# Altium schematic sheet PS3604LRCF.SchDoc: PS3604LRCF
size A3; Author: Storozhenko Roman; CompanyName: D_EL; DrawnBy: Storozhenko Roman; Address1: Ukraine; Address2: Kharkiv; Revision: 1.1; SheetNumber: 1; SheetTotal: 1
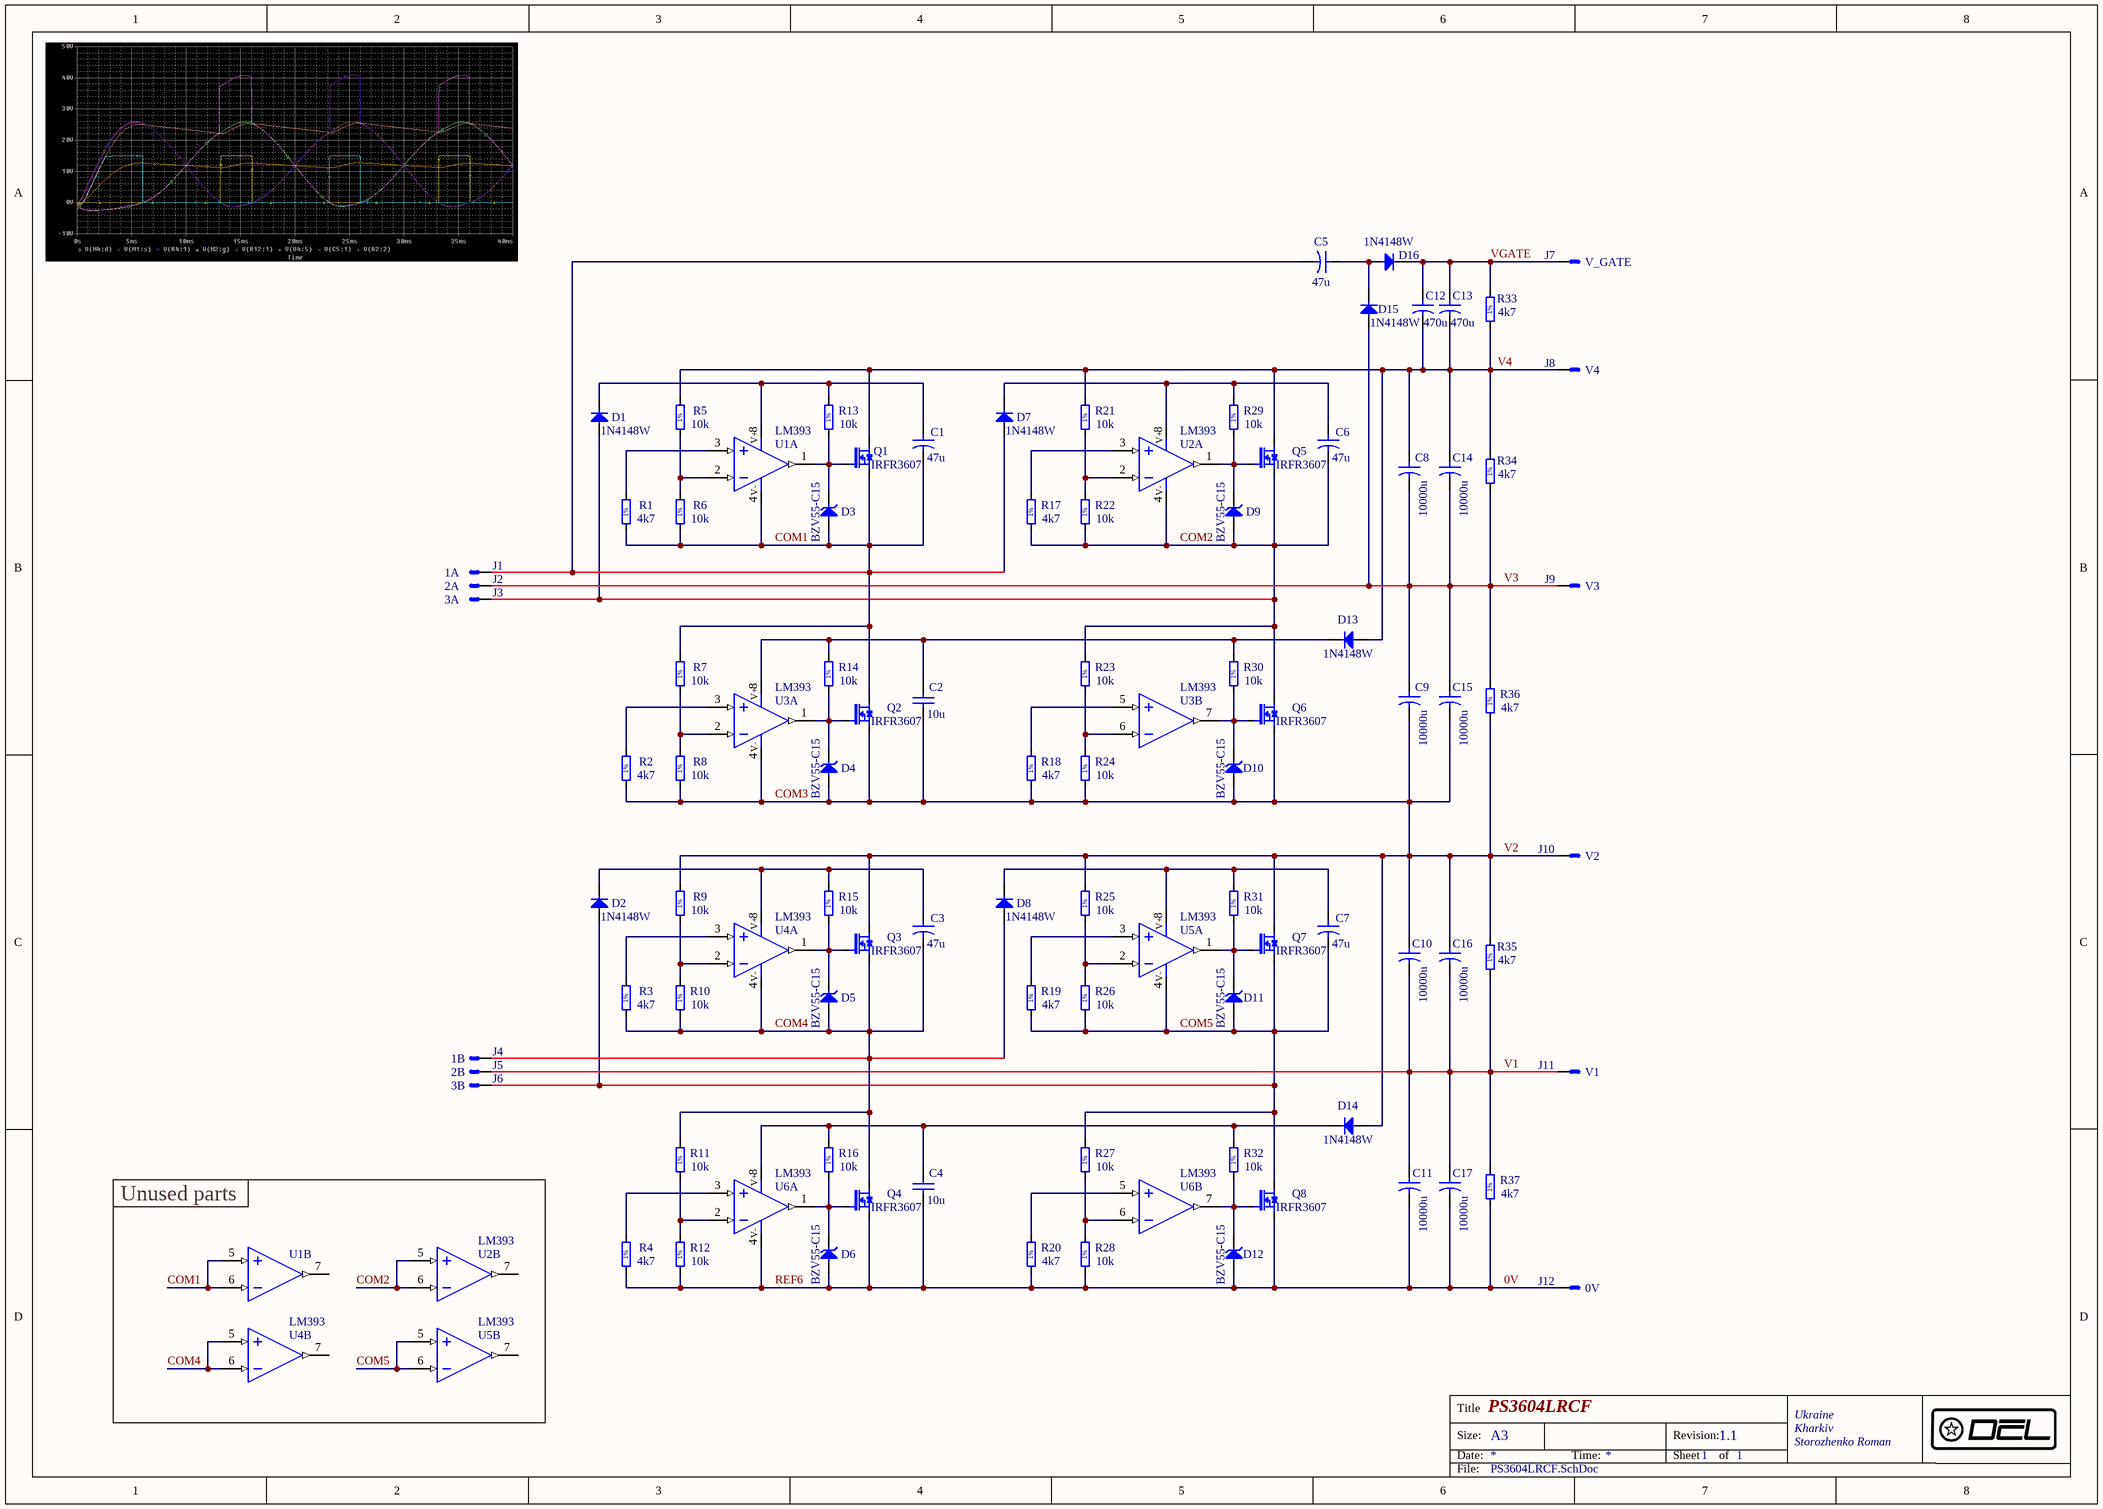
[diagram p0: PS3604LRCF.SchDoc]

## Parts
C1  47u  [CAPPR250-630X1120]
C2  10u  [CAPC2012X135N]
C3  47u  [CAPPR250-630X1120]
C4  10u  [CAPC2012X135N]
C5  47u  [CAPPR250-630X1120]
C6  47u  [CAPPR250-630X1120]
C7  47u  [CAPPR250-630X1120]
C8  10000u  [CAPPR750-1850X3750]
C9  10000u  [CAPPR750-1850X3750]
C10  10000u  [CAPPR750-1850X3750]
C11  10000u  [CAPPR750-1850X3750]
C12  470u  [CAPPR500-1050X2200]
C13  470u  [CAPPR500-1050X2200]
C14  10000u  [CAPPR750-1850X3750]
C15  10000u  [CAPPR750-1850X3750]
C16  10000u  [CAPPR750-1850X3750]
C17  10000u  [CAPPR750-1850X3750]
D1  1N4148W  [SOD3715X145N]
D2  1N4148W  [SOD3715X145N]
D3  BZV55-C15  [DIOMELF3515N]
D4  BZV55-C15  [DIOMELF3515N]
D5  BZV55-C15  [DIOMELF3515N]
D6  BZV55-C15  [DIOMELF3515N]
D7  1N4148W  [SOD3715X145N]
D8  1N4148W  [SOD3715X145N]
D9  BZV55-C15  [DIOMELF3515N]
D10  BZV55-C15  [DIOMELF3515N]
D11  BZV55-C15  [DIOMELF3515N]
D12  BZV55-C15  [DIOMELF3515N]
D13  1N4148W  [SOD3715X145N]
D14  1N4148W  [SOD3715X145N]
D15  1N4148W  [SOD3715X145N]
D16  1N4148W  [SOD3715X145N]
J1  Quixon™  [MOLEX_19_70_54203]  (value not drawn)
J2  Quixon™  [MOLEX_19_70_54203]  (value not drawn)
J3  Quixon™  [MOLEX_19_70_54203]  (value not drawn)
J4  Quixon™  [MOLEX_19_70_54203]  (value not drawn)
J5  Quixon™  [MOLEX_19_70_54203]  (value not drawn)
J6  Quixon™  [MOLEX_19_70_54203]  (value not drawn)
J7  Quixon™  [MOLEX_19_70_54203]  (value not drawn)
J8  Quixon™  [MOLEX_19_70_54203]  (value not drawn)
J9  Quixon™  [MOLEX_19_70_54203]  (value not drawn)
J10  Quixon™  [MOLEX_19_70_54203]  (value not drawn)
J11  Quixon™  [MOLEX_19_70_54203]  (value not drawn)
J12  Quixon™  [MOLEX_19_70_54203]  (value not drawn)
Q1  IRFR3607  [TO228P991X239-3N-R546X521]
Q2  IRFR3607  [TO228P991X239-3N-R546X521]
Q3  IRFR3607  [TO228P991X239-3N-R546X521]
Q4  IRFR3607  [TO228P991X239-3N-R546X521]
Q5  IRFR3607  [TO228P991X239-3N-R546X521]
Q6  IRFR3607  [TO228P991X239-3N-R546X521]
Q7  IRFR3607  [TO228P991X239-3N-R546X521]
Q8  IRFR3607  [TO228P991X239-3N-R546X521]
R1  4k7  [RESC1608X55N]
R2  4k7  [RESC1608X55N]
R3  4k7  [RESC1608X55N]
R4  4k7  [RESC1608X55N]
R5  10k  [RESC1608X55N]
R6  10k  [RESC1608X55N]
R7  10k  [RESC1608X55N]
R8  10k  [RESC1608X55N]
R9  10k  [RESC1608X55N]
R10  10k  [RESC1608X55N]
R11  10k  [RESC1608X55N]
R12  10k  [RESC1608X55N]
R13  10k  [RESC1608X55N]
R14  10k  [RESC1608X55N]
R15  10k  [RESC1608X55N]
R16  10k  [RESC1608X55N]
R17  4k7  [RESC1608X55N]
R18  4k7  [RESC1608X55N]
R19  4k7  [RESC1608X55N]
R20  4k7  [RESC1608X55N]
R21  10k  [RESC1608X55N]
R22  10k  [RESC1608X55N]
R23  10k  [RESC1608X55N]
R24  10k  [RESC1608X55N]
R25  10k  [RESC1608X55N]
R26  10k  [RESC1608X55N]
R27  10k  [RESC1608X55N]
R28  10k  [RESC1608X55N]
R29  10k  [RESC1608X55N]
R30  10k  [RESC1608X55N]
R31  10k  [RESC1608X55N]
R32  10k  [RESC1608X55N]
R33  4k7  [RESC1608X55N]
R34  4k7  [RESC1608X55N]
R35  4k7  [RESC1608X55N]
R36  4k7  [RESC1608X55N]
R37  4k7  [RESC1608X55N]
U1  LM393  [SOIC127P600X175-8N]  (parts A,B of 2)
U2  LM393  [SOIC127P600X175-8N]  (parts A,B of 2)
U3  LM393  [SOIC127P600X175-8N]  (parts A,B of 2)
U4  LM393  [SOIC127P600X175-8N]  (parts A,B of 2)
U5  LM393  [SOIC127P600X175-8N]  (parts A,B of 2)
U6  LM393  [SOIC127P600X175-8N]  (parts A,B of 2)

## Blocks framed on the sheet
Unused parts: U1 U2 U4 U5

## Nets
0V: C4.1 C11.2 C17.2 D6.2(A) D12.2(A) J12.1 Q4.2(S) Q8.2(S) R4.1 R12.1 R20.1 R28.1 R37.1 U6.4(V-)  [also labelled REF6]
COM1: C1.2 C5.2 D3.2(A) D7.2(A) J1.1 Q1.2(S) Q2.3(D) R1.1 R6.1 R7.2 U1.4(V-) U1.5(IN+) U1.6(IN-)
COM2: C6.2 D1.2(A) D9.2(A) J3.1 Q5.2(S) Q6.3(D) R17.1 R22.1 R23.2 U2.4(V-) U2.5(IN+) U2.6(IN-)
COM3: C2.1 C9.2 C10.1 C15.2 C16.1 D4.2(A) D10.2(A) D14.2(A) J10.1 Q2.2(S) Q3.3(D) Q6.2(S) Q7.3(D) R2.1 R8.1 R9.2 R18.1 R24.1 R25.2 R35.2 R36.1 U3.4(V-)  [also labelled V2]
COM4: C3.2 D5.2(A) D8.2(A) J4.1 Q3.2(S) Q4.3(D) R3.1 R10.1 R11.2 U4.4(V-) U4.5(IN+) U4.6(IN-)
COM5: C7.2 D2.2(A) D11.2(A) J6.1 Q7.2(S) Q8.3(D) R19.1 R26.1 R27.2 U5.4(V-) U5.5(IN+) U5.6(IN-)
V1: C10.2 C11.1 C16.2 C17.1 J5.1 J11.1 R35.1 R37.2
V3: C8.2 C9.1 C14.2 C15.1 D15.2(A) J2.1 J9.1 R34.1 R36.2
V4: C8.1 C12.2 C13.2 C14.1 D13.2(A) J8.1 Q1.3(D) Q5.3(D) R5.2 R21.2 R33.1 R34.2
VGATE: C12.1 C13.1 D16.1(C) J7.1 R33.2
NetC1_1: C1.1 D1.1(C) R13.2 U1.8(V+)
NetC2_2: C2.2 D13.1(C) R14.2 R30.2 U3.8(V+)
NetC3_1: C3.1 D2.1(C) R15.2 U4.8(V+)
NetC4_2: C4.2 D14.1(C) R16.2 R32.2 U6.8(V+)
NetC5_1: C5.1 D15.1(C) D16.2(A)
NetC6_1: C6.1 D7.1(C) R29.2 U2.8(V+)
NetC7_1: C7.1 D8.1(C) R31.2 U5.8(V+)
NetD3_1: D3.1(C) Q1.1(G) R13.1 U1.1(OUT)
NetD4_1: D4.1(C) Q2.1(G) R14.1 U3.1(OUT)
NetD5_1: D5.1(C) Q3.1(G) R15.1 U4.1(OUT)
NetD6_1: D6.1(C) Q4.1(G) R16.1 U6.1(OUT)
NetD9_1: D9.1(C) Q5.1(G) R29.1 U2.1(OUT)
NetD10_1: D10.1(C) Q6.1(G) R30.1 U3.7(OUT)
NetD11_1: D11.1(C) Q7.1(G) R31.1 U5.1(OUT)
NetD12_1: D12.1(C) Q8.1(G) R32.1 U6.7(OUT)
NetR1_2: R1.2 U1.3(IN+)
NetR2_2: R2.2 U3.3(IN+)
NetR3_2: R3.2 U4.3(IN+)
NetR4_2: R4.2 U6.3(IN+)
NetR5_1: R5.1 R6.2 U1.2(IN-)
NetR7_1: R7.1 R8.2 U3.2(IN-)
NetR9_1: R9.1 R10.2 U4.2(IN-)
NetR11_1: R11.1 R12.2 U6.2(IN-)
NetR17_2: R17.2 U2.3(IN+)
NetR18_2: R18.2 U3.5(IN+)
NetR19_2: R19.2 U5.3(IN+)
NetR20_2: R20.2 U6.5(IN+)
NetR21_1: R21.1 R22.2 U2.2(IN-)
NetR23_1: R23.1 R24.2 U3.6(IN-)
NetR25_1: R25.1 R26.2 U5.2(IN-)
NetR27_1: R27.1 R28.2 U6.6(IN-)

Not connected (* = marked no-connect by the designer): U1 7(OUT); U2 7(OUT); U4 7(OUT); U5 7(OUT)

## Notes on the sheet
- (near J7) V_GATE
- (near J8) V4
- 1A
- 2A
- (near J9) V3
- 3A
- (near J10) V2
- 1B
- 2B
- 3B
- (near J11) V1
- (near J12) 0V
- Title
- Size:
- Date:
- A3
- Time:
- Revision:
- Sheet
- of
- File:
- (in symbol R0603_4K7_1%_0.1W_100PPM) 1%
- (in symbol R0603_10K_1%_0.1W_100PPM) 1%

## Library data of the parts
C1 C3 C5-C7 = CAER_47UF_50V_20%_EXR470M50B: Polarised capacitor; Part Description: Aluminum Electrolytic Capacitor (EXR Serie); Manufacturer: HITANO; Voltage: 50V; Tolerance: ±20%; Part Number: CAER_47UF_50V_20%_EXR470M50B; Component Kind: Standard; Component Type: Standard; Pin Count: 2; Value: 47u; Status: None; Manufacturer Part Number: EXR470M50B; Case: LS2.5 D6.3 x H11; Mounted: Yes; Socket: No; SMD: No; ComponentHeight: 11mm; Author: DEL; CreateDate: 09.03.2018; LatestRevisionDate: 09.03.2018
C2 C4 = CC0805_10UF_16V_10%_X7R: Non-polarised capacitor; Part Description: SMD Multilayer Chip Ceramic Capacitor; Manufacturer: GENERIC; Manufacturer1 Part Number: C0805C106K4PAC; Voltage: 16V; TC: X7R; Tolerance: ±10%; Part Number: CC0805_10UF_16V_10%_X7R; Component Kind: Standard; Component Type: Standard; Pin Count: 2; Value: 10u; Status: Preferred; Manufacturer Part Number: CC0805_10UF_16V_10%_X7R; Case: 0805; Mounted: Yes; Socket: No; SMD: Yes; Manufacturer1 Example: KEMET; Manufacturer1 ComponentHeight: 1.4mm; HelpURL: \\cern.ch\dfs\Applications\Altium\Datasheets\CC1206_X5R_KEMET.pdf; Author: ELMAN; CreateDate: 14.04.2016; LatestRevisionDate: 14.04.2016
C8-C11 C14-C17 = CAER_10000UF_16V_20%_EXR103M16B: Polarised capacitor; Part Description: Aluminum Electrolytic Capacitor (EXR Serie); Manufacturer: HITANO; Voltage: 16V; Tolerance: ±20%; Part Number: CAER_10000UF_16V_20%_EXR103M16B; Component Kind: Standard; Component Type: Standard; Pin Count: 2; Value: 10000u; Status: None; Manufacturer Part Number: EXR103M16B; Case: LS7.5 D18 x H36; Mounted: Yes; Socket: No; SMD: No; ComponentHeight: 36mm; Author: DEL; CreateDate: 09.03.2018; LatestRevisionDate: 09.03.2018
C12 C13 = CAER_470UF_35V_20%_EXR471M35B: Polarised capacitor; Part Description: Aluminum Electrolytic Capacitor (EXR Serie); Manufacturer: HITANO; Voltage: 36V; Tolerance: ±20%; Part Number: CAER_470UF_35V_20%_EXR471M35B; Component Kind: Standard; Component Type: Standard; Pin Count: 2; Value: 470u; Status: None; Manufacturer Part Number: EXR471M35B; Case: LS5 D10 x H21; Mounted: Yes; Socket: No; SMD: No; ComponentHeight: 21mm; Author: DEL; CreateDate: 09.03.2018; LatestRevisionDate: 09.03.2018
D1 D2 D7 D8 D13-D16 = 1N4148W: Diode; Part Description: Small Signal Diode; Manufacturer: VISHAY SEMICONDUCTORS; Manufacturer Part Number: 1N4148W-E3-08; Voltage: 75V; Power: 150mA; Part Number: 1N4148W; Component Kind: Standard; Component Type: Standard; Device: 1N4148W; PackageDescription: SOD Diode (SOD-123); 2.70mm W X 1.55mm L X 1.45mm H body, IPC Medium Density; Pin Count: 2; Case: SOD-123; Mounted: Yes; Socket: No; SMD: Yes; ComponentHeight: 1.45mm; Author: DEL; CreateDate: 27.01.2018; LatestRevisionDate: 27.01.2018
D3-D6 D9-D12 = BZV55-C15: Zener Diode; Part Description: Voltage Regulator Diode; Manufacturer: PHILIPS NXP; Voltage: 15V; Power: 500mW; Part Number: BZV55-C15; Component Kind: Standard; Component Type: Standard; Device: BZV55-C15; PackageDescription: SOD80C, MELF Diode, 2-Leads, Body 3.5x1.5mm, IPC Medium Density; Manufacturer Part Number: BZV55-C15; Pin Count: 2; Case: SOD-80C; Mounted: Yes; Socket: No; SMD: Yes; ComponentHeight: 1.6mm; HelpURL: \\cern.ch\dfs\Applications\Altium\Datasheets\BZV55.pdf; Author: CERN DEM JLC; CreateDate: 06.05.2008; LatestRevisionDate: 06.05.2008
J1-J12 = MOLEX_19_70_54203: Single Pin Male; Part Description: 0.250" (6.35mm) Quick Connect Male Solder Connector Non-Insulated; Manufacturer: MOLEX; Part Number: MOLEX_19_70_54203; Component Kind: Standard; Component Type: Standard; Pin Count: 1; Family: Quixon™; Mounted: Yes; Socket: No; SMD: No; Status: None; Manufacturer Part Number: 19_70_54203; ComponentHeight: 10.29mm; Author: DEL; CreateDate: 09.03.2018; LatestRevisionDate: 09.03.2018
Q1-Q8 = IRFR3607PbF: N-CHANNEL MOSFET WITH DIODE; Part Description: 75V 56A 7.34 mOhm N-Channel; Manufacturer: INTERNATIONAL RECTIFIER; Part Number: IRFR3607PbF; Component Kind: Standard; Component Type: Standard; Device: IRFR3607; PackageDescription: TO-252AA DPAK TO, 2.28mm pitch; 2 pin,9.905mm L X 6.095mm W X 2.39mm H body, IPC Medium Density; Manufacturer Part Number: IRFR3607PbF; Pin Count: 3; Case: DPAK; Mounted: Yes; Socket: No; SMD: Yes; ComponentHeight: 2.39mm; Author: DEL; CreateDate: 09.03.2018; LatestRevisionDate: 09.03.2018
R1-R4 R17-R20 R33-R37 = R0603_4K7_1%_0.1W_100PPM: Resistor - 1%; Part Description: General Purpose Thick Film Chip Resistor; Manufacturer: GENERIC; Manufacturer1 Part Number: NRC06F4701TRF; Power: 0.1W; TC: ±100ppm/°C; Part Number: R0603_4K7_1%_0.1W_100PPM; Component Kind: Standard; Component Type: Standard; Pin Count: 2; Value: 4k7; Status: Preferred; Tolerance: ±1%; Manufacturer Part Number: R0603_4K7_1%_0.1W_100PPM; Case: 0603; Mounted: Yes; Socket: No; SMD: Yes; Manufacturer1 Example: NIC COMPONENT; Manufacturer1 ComponentHeight: 0.55mm; HelpURL: \\cern.ch\dfs\Applications\Altium\Datasheets\R0603_NIC_NRC.pdf; Author: CERN DEM JLC; CreateDate: 03.12.2007; LatestRevisionDate: 13.03.2008
R5-R16 R21-R32 = R0603_10K_1%_0.1W_100PPM: Resistor - 1%; Part Description: General Purpose Thick Film Chip Resistor; Manufacturer: GENERIC; Manufacturer1 Part Number: NRC06F1002TRF; Power: 0.1W; TC: ±100ppm/°C; Part Number: R0603_10K_1%_0.1W_100PPM; Component Kind: Standard; Component Type: Standard; Pin Count: 2; Value: 10k; Status: Preferred; Tolerance: ±1%; Manufacturer Part Number: R0603_10K_1%_0.1W_100PPM; Case: 0603; Mounted: Yes; Socket: No; SMD: Yes; Manufacturer1 Example: NIC COMPONENT; Manufacturer1 ComponentHeight: 0.55mm; HelpURL: \\cern.ch\dfs\Applications\Altium\Datasheets\R0603_NIC_NRC.pdf; Author: CERN DEM JLC; CreateDate: 03.12.2007; LatestRevisionDate: 13.03.2008
U1-U6 = LM393M/NOPB: Dual Operational Amplifier; Part Description: Low Power Low Offset Voltage Dual Comparators; Manufacturer: NATIONAL SEMICONDUCTOR; Part Number: LM393M/NOPB; Component Kind: Standard; Component Type: Standard; Device: LM393; PackageDescription: SOIC 8, Pitch 1.27mm - Body 4x5mm, IPC Medium Density; Manufacturer Part Number: LM393M/NOPB; Pin Count: 8; Case: SOIC8; Mounted: Yes; Socket: No; SMD: Yes; ComponentHeight: 1.75mm; Author: CERN DEM JLC; HelpURL: \\cern.ch\dfs\Applications\Altium\Datasheets\LM393M-NOPB.pdf; CreateDate: 18.11.2011; LatestRevisionDate: 18.11.2011